# Altium project emulator_adapter_v2.PrjPcb
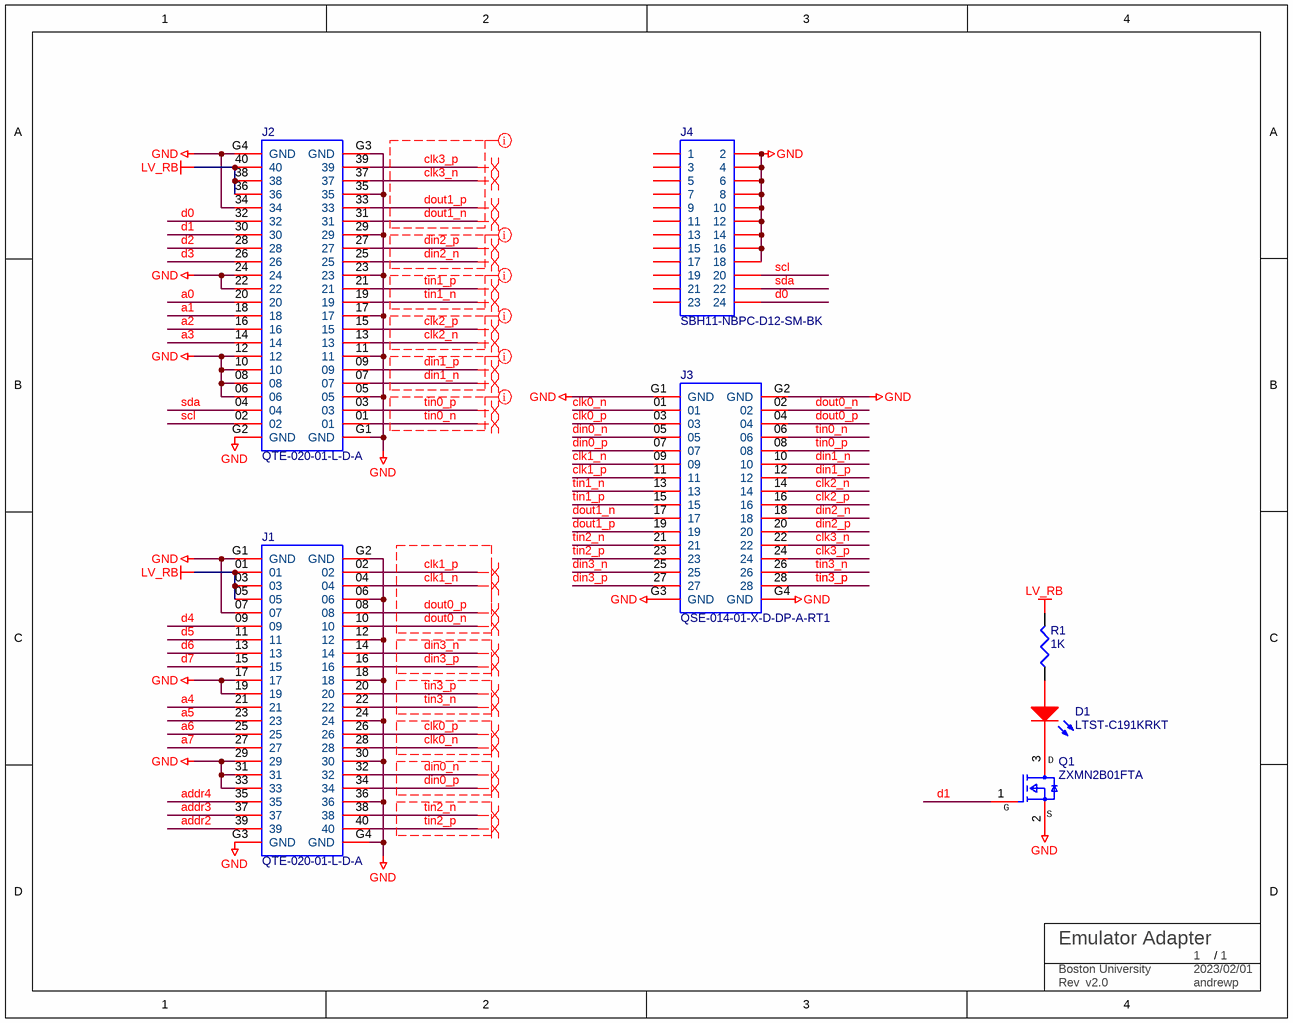
[diagram p0: emulator_adapter.SchDoc]
1 sheet, 8 parts. Net scope: global (net labels, ports and power ports of the same name join across sheets).
Board file: emulator_adapter.PcbDoc

## Sheet emulator_adapter.SchDoc: Emulator Adapter
size A; Date: 2023/02/01; Author: AP; DrawnBy: andrewp; Organization: Boston University; DocumentNumber: 1; Revision: v2.0; SheetNumber: 1; SheetTotal: 1; Time: Emulator Adapter

### Parts
D1  LTST-C191KRKT  [LED_RED]
J1  QTE-020-01-L-D-A  [SAMTEC_QTE-020-01-L-D-A-FL-K-TR]
J2  QTE-020-01-L-D-A  [SAMTEC_QTE-020-01-L-D-A-FL-K-TR]
J3  QSE-014-01-X-D-DP-A-RT1  [SAMTEC_QSE-014-01-F-D-DP-A]
J4  SBH11-NBPC-D12-SM-BK  [SULLINS_SBH11-NBPC-D12-SM-BK]
Q1  ZXMN2B01FTA  [SOT-23]
R1  Parameter 1: 1K  [resc1005n]  (hidden comment: ERJ-2GEJ201X)
TBLOCK?  BU Title block  (value not drawn)  (graphical)

### Nets
GND: J1.06 J1.07 J1.12 J1.17 J1.18 J1.19 J1.24 J1.29 J1.30 J1.31 J1.33 J1.36 J1.G1(GND) J1.G2(GND) J1.G3(GND) J1.G4(GND) J2.05 J2.06 J2.08 J2.10 J2.11 J2.12 J2.17 J2.22 J2.23 J2.24 J2.29 J2.34 J2.35 J2.G1(GND) J2.G2(GND) J2.G3(GND) J2.G4(GND) J3.G1(GND) J3.G2(GND) J3.G3(GND) J3.G4(GND) J4.2 J4.4 J4.6 J4.8 J4.10 J4.12 J4.14 J4.16 J4.18 Q1.2(Source)
LV_RB: J1.01 J1.03 J1.05 J2.36 J2.38 J2.40 R1.2
a0: J2.20
a1: J2.18
a2: J2.16
a3: J2.14
a4: J1.21
a5: J1.23
a6: J1.25
a7: J1.27
addr2: J1.39
addr3: J1.37
addr4: J1.35
clk0_n: J1.28 J3.01
clk0_p: J1.26 J3.03
clk1_n: J1.04 J3.09
clk1_p: J1.02 J3.11
clk2_n: J2.13 J3.14
clk2_p: J2.15 J3.16
clk3_n: J2.37 J3.22
clk3_p: J2.39 J3.24
d0: J2.32 J4.24
d1: J2.30 Q1.1(Gate)
d2: J2.28
d3: J2.26
d4: J1.09
d5: J1.11
d6: J1.13
d7: J1.15
din0_n: J1.32 J3.05
din0_p: J1.34 J3.07
din1_n: J2.07 J3.10
din1_p: J2.09 J3.12
din2_n: J2.25 J3.18
din2_p: J2.27 J3.20
din3_n: J1.14 J3.25
din3_p: J1.16 J3.27
dout0_n: J1.10 J3.02
dout0_p: J1.08 J3.04
dout1_n: J2.31 J3.17
dout1_p: J2.33 J3.19
scl: J2.02 J4.20
sda: J2.04 J4.22
tin0_n: J2.01 J3.06
tin0_p: J2.03 J3.08
tin1_n: J2.19 J3.13
tin1_p: J2.21 J3.15
tin2_n: J1.38 J3.21
tin2_p: J1.40 J3.23
tin3_n: J1.22 J3.26
tin3_p: J1.20 J3.28
NetD1_1: D1.1(A) R1.1
NetD1_2: D1.2(K) Q1.3(Drain)

Not connected (* = marked no-connect by the designer): J4 1 3 5 7 9 11 13 15 17 19 21 23

### Layout directives
net class Dout_1: clk2_n, clk2_p, clk3_n, clk3_p, dout1_n, dout1_p
net class Din_1: din1_n, din1_p, din2_n, din2_p
net class Din_T_1: tin0_n, tin0_p, tin1_n, tin1_p
differential pair: clk0_n, clk0_p, clk1_n, clk1_p, clk2_n, clk2_p, clk3_n, clk3_p, din0_n, din0_p, din1_n, din1_p, din2_n, din2_p, din3_n, din3_p, dout0_n, dout0_p, dout1_n, dout1_p, tin0_n, tin0_p, tin1_n, tin1_p, tin2_n, tin2_p, tin3_n, tin3_p

### Notes on the sheet
- (in symbol TITLE_BLOCK_BU) /; Rev
- (in symbol ZXMN2B01FTA) D; G; S

### Library data of the parts
D1 = LED_RED: Typical RED, GREEN, YELLOW, AMBER GaAs LED; Published: 8-Jun-2000; LatestRevisionDate: 17-Jul-2002; LatestRevisionNote: Re-released for DXP Platform.; PackageVersion: Feb-2002; PackageReference: 3.2X1.6X1.1; Publisher: Altium Limited; PackageDescription: SM LED; 2 Flat Leads
J1 J2 = QTE-020-01-XXX-D: 40 Position Connector Receptacle, Center Strip Contacts Surface Mount Gold; MF: Samtec; MP: QSE-020-01-F-D; SnapEDA_Link: https://www.snapeda.com/parts/QSE-020-01-F-D/Samtec/view-part/1737145/?ref=snap; Value: *; Availability: Bad; Price: None; Toby_UK-Purchase-URL: https://snapeda.com/shop?store=Toby+UK&id=1737145; Package: MAPBGA-624 Samtec
J3 = QSE-014-01-XXX-D: 28 Position Connector Receptacle, Center Strip Contacts Surface Mount Gold; MF: Samtec; MP: QSE-020-01-F-D; SnapEDA_Link: https://www.snapeda.com/parts/QSE-020-01-F-D/Samtec/view-part/1737145/?ref=snap; Value: *; Availability: Bad; Price: None; Toby_UK-Purchase-URL: https://snapeda.com/shop?store=Toby+UK&id=1737145; Package: MAPBGA-624 Samtec
J4 = Header 12X2: Header, 24-Pin, Dual row; LatestRevisionDate: 17-Jul-2002; LatestRevisionNote: Re-released for DXP Platform.; Publisher: Altium Limited
Q1 = ZXMN2B01FTA: MOSFET N-CH 20V 2.1A SOT-23-3; ComponentLink2Description: Datasheet; ComponentLink2URL: https://www.diodes.com/assets/Datasheets/ZXMN2B01F.pdf
R1 = R1: FILM RESISTOR; Text Field2: 5%
TBLOCK? = TITLE_BLOCK_BU